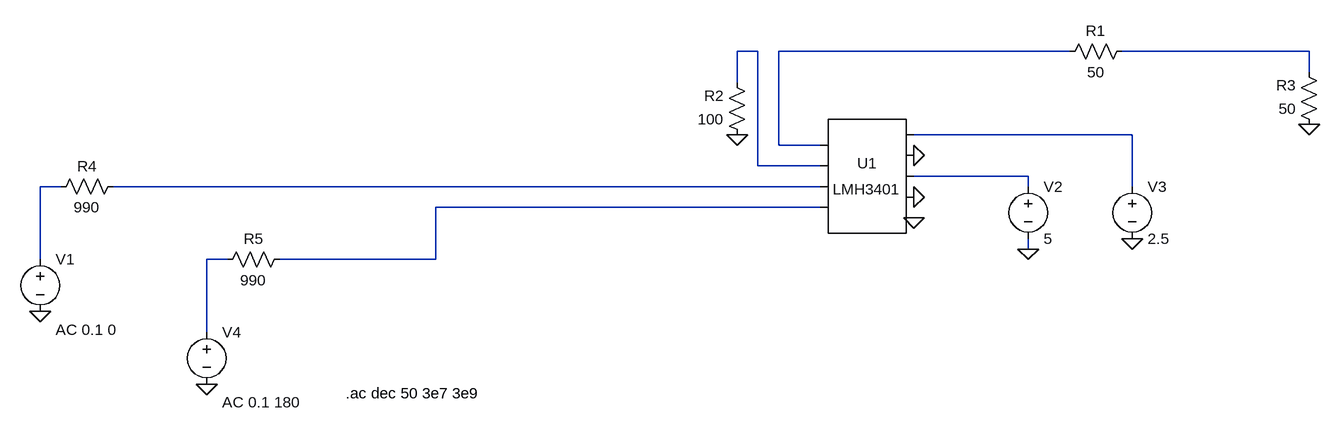
[diagram p0: schematic Draft11.asc]
Draft11.asc, the LTspice schematic file:
Version 4
SHEET 1 880 680
WIRE -16 -32 -48 -32
WIRE 464 -32 16 -32
WIRE 832 -32 544 -32
WIRE 832 0 832 -32
WIRE -48 16 -48 -32
WIRE 560 96 224 96
WIRE 16 112 16 -32
WIRE 80 112 16 112
WIRE -16 144 -16 -32
WIRE 80 144 -16 144
WIRE 400 160 224 160
WIRE -1088 176 -1120 176
WIRE 80 176 -1008 176
WIRE 400 176 400 160
WIRE 560 176 560 96
WIRE 80 208 -512 208
WIRE 400 272 400 256
WIRE -1120 288 -1120 176
WIRE -832 288 -864 288
WIRE -512 288 -512 208
WIRE -512 288 -752 288
WIRE -864 400 -864 288
FLAG -1120 368 0
FLAG -48 96 0
FLAG 832 80 0
FLAG 224 224 0
FLAG -864 480 0
FLAG 224 192 0
FLAG 560 256 0
FLAG 224 128 0
FLAG 400 272 0
SYMBOL AutoGenerated\\LMH3401 144 160 R0
SYMATTR InstName U1
SYMBOL voltage -1120 272 R0
WINDOW 123 24 124 Left 2
WINDOW 39 0 0 Left 0
SYMATTR InstName V1
SYMATTR Value ""
SYMATTR Value2 AC 0.1 0
SYMBOL res 560 -48 R90
WINDOW 0 0 56 VBottom 2
WINDOW 3 32 56 VTop 2
SYMATTR InstName R1
SYMATTR Value 50
SYMBOL res -32 112 R180
WINDOW 0 36 76 Left 2
WINDOW 3 36 40 Left 2
SYMATTR InstName R2
SYMATTR Value 100
SYMBOL res 848 96 R180
WINDOW 0 36 76 Left 2
WINDOW 3 36 40 Left 2
SYMATTR InstName R3
SYMATTR Value 50
SYMBOL voltage 400 160 R0
WINDOW 123 0 0 Left 0
WINDOW 39 0 0 Left 0
SYMATTR InstName V2
SYMATTR Value 5
SYMBOL voltage -864 384 R0
WINDOW 123 24 124 Left 2
WINDOW 39 0 0 Left 0
SYMATTR InstName V4
SYMATTR Value ""
SYMATTR Value2 AC 0.1 180
SYMBOL res -992 160 R90
WINDOW 0 0 56 VBottom 2
WINDOW 3 32 56 VTop 2
SYMATTR InstName R4
SYMATTR Value 990
SYMBOL res -736 272 R90
WINDOW 0 0 56 VBottom 2
WINDOW 3 32 56 VTop 2
SYMATTR InstName R5
SYMATTR Value 990
SYMBOL voltage 560 160 R0
WINDOW 123 0 0 Left 0
WINDOW 39 0 0 Left 0
SYMATTR InstName V3
SYMATTR Value 2.5
TEXT -650 494 Left 2 !.ac dec 50 3e7 3e9

The netlist it stands for:
* Draft11.asc
* U1: LMH3401 (symbol AutoGenerated\LMH3401 not available, pins judged from their places): pin1=N002 pin2=N001 pin3=N007 pin4=N008 pin5=N004 pin6=0 pin7=N005 pin8=0 pin9=0
V1 N006 0 AC 0.1 0
R1 N003 N002 50
R2 0 N001 100
R3 0 N003 50
V2 N005 0 5
V4 N009 0 AC 0.1 180
R4 N007 N006 990
R5 N008 N009 990
V3 N004 0 2.5
.ac dec 50 3e7 3e9
.backanno
.end